# EAGLE design Breakout (EAGLE 9.4.1)
DESIGNER: Hendrik Melse; PROJECT: Backplane Breakout; REV: 1.0.0
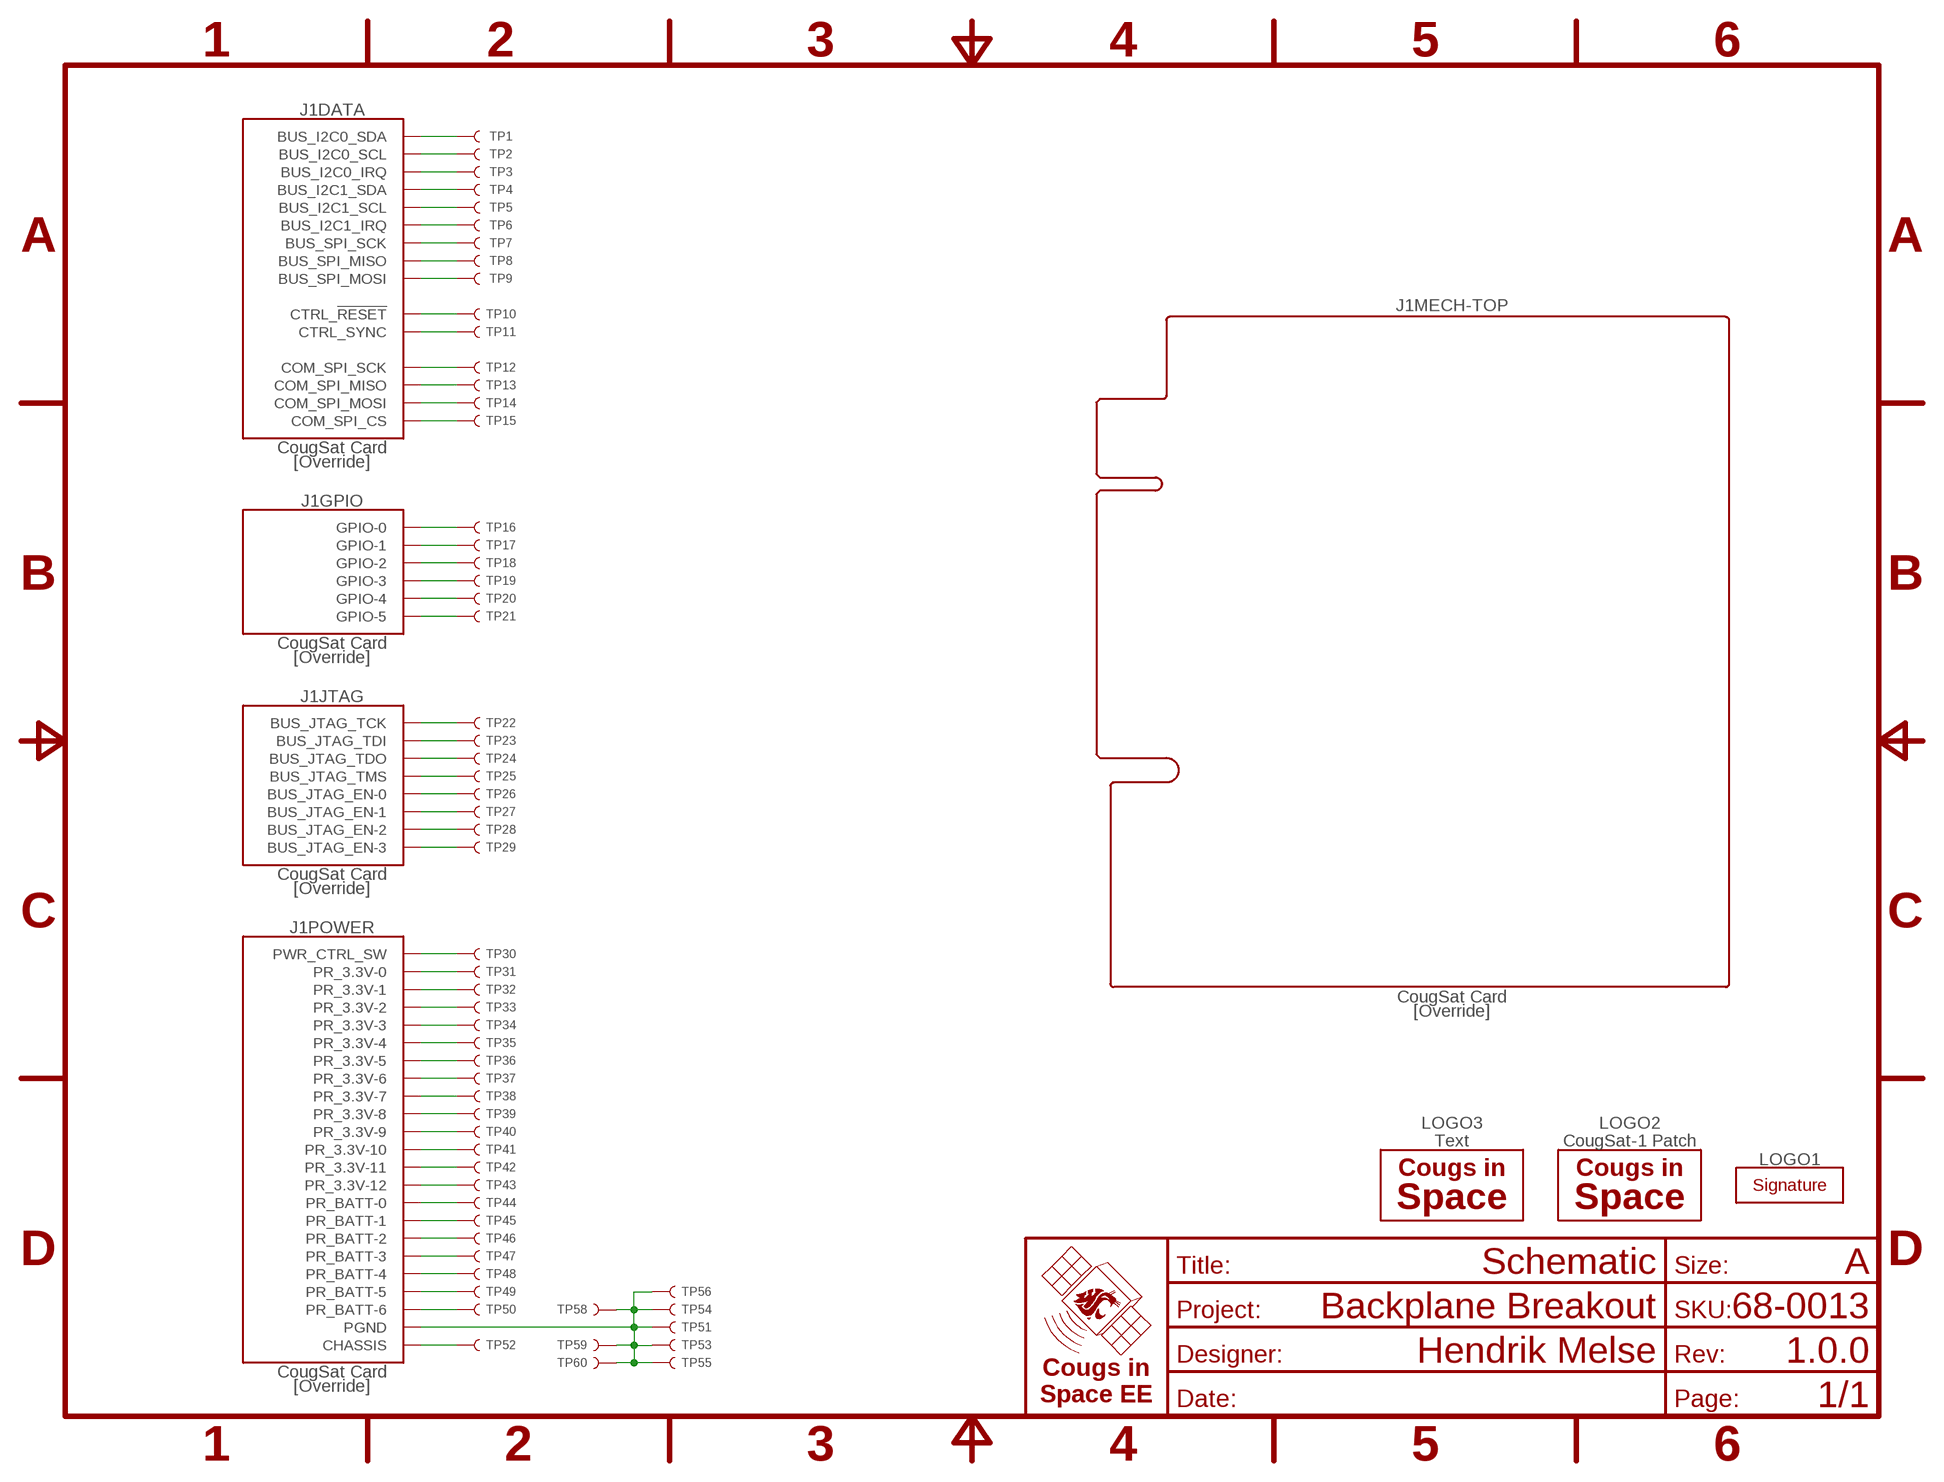
[diagram p0: schematic, sheet 1]
FRAME1 (FRAME-A): PART_NUMBER: 68-0013; TITLE: Schematic

## Parts
J1  CougSat Card  CIS_CARD  [CARD-FULL]
LOGO1  SIGNATUREHENDRIK  [SIGN-HENDRIK]
LOGO2  CougSat-1 Patch  CIS-LOGO-PATCH-1  [CIS-PATCH-1]
LOGO3  Text  CIS-LOGO-TEXT  [CIS-TEXT]
TP1  TEST_POINT-THT-1.0  [THT-1.0]
TP2  TEST_POINT-THT-1.0  [THT-1.0]
TP3  TEST_POINT-THT-1.0  [THT-1.0]
TP4  TEST_POINT-THT-1.0  [THT-1.0]
TP5  TEST_POINT-THT-1.0  [THT-1.0]
TP6  TEST_POINT-THT-1.0  [THT-1.0]
TP7  TEST_POINT-THT-1.0  [THT-1.0]
TP8  TEST_POINT-THT-1.0  [THT-1.0]
TP9  TEST_POINT-THT-1.0  [THT-1.0]
TP10  TEST_POINT-THT-1.0  [THT-1.0]
TP11  TEST_POINT-THT-1.0  [THT-1.0]
TP12  TEST_POINT-THT-1.0  [THT-1.0]
TP13  TEST_POINT-THT-1.0  [THT-1.0]
TP14  TEST_POINT-THT-1.0  [THT-1.0]
TP15  TEST_POINT-THT-1.0  [THT-1.0]
TP16  TEST_POINT-THT-1.0  [THT-1.0]
TP17  TEST_POINT-THT-1.0  [THT-1.0]
TP18  TEST_POINT-THT-1.0  [THT-1.0]
TP19  TEST_POINT-THT-1.0  [THT-1.0]
TP20  TEST_POINT-THT-1.0  [THT-1.0]
TP21  TEST_POINT-THT-1.0  [THT-1.0]
TP22  TEST_POINT-THT-1.0  [THT-1.0]
TP23  TEST_POINT-THT-1.0  [THT-1.0]
TP24  TEST_POINT-THT-1.0  [THT-1.0]
TP25  TEST_POINT-THT-1.0  [THT-1.0]
TP26  TEST_POINT-THT-1.0  [THT-1.0]
TP27  TEST_POINT-THT-1.0  [THT-1.0]
TP28  TEST_POINT-THT-1.0  [THT-1.0]
TP29  TEST_POINT-THT-1.0  [THT-1.0]
TP30  TEST_POINT-THT-1.0  [THT-1.0]
TP31  TEST_POINT-THT-1.0  [THT-1.0]
TP32  TEST_POINT-THT-1.0  [THT-1.0]
TP33  TEST_POINT-THT-1.0  [THT-1.0]
TP34  TEST_POINT-THT-1.0  [THT-1.0]
TP35  TEST_POINT-THT-1.0  [THT-1.0]
TP36  TEST_POINT-THT-1.0  [THT-1.0]
TP37  TEST_POINT-THT-1.0  [THT-1.0]
TP38  TEST_POINT-THT-1.0  [THT-1.0]
TP39  TEST_POINT-THT-1.0  [THT-1.0]
TP40  TEST_POINT-THT-1.0  [THT-1.0]
TP41  TEST_POINT-THT-1.0  [THT-1.0]
TP42  TEST_POINT-THT-1.0  [THT-1.0]
TP43  TEST_POINT-THT-1.0  [THT-1.0]
TP44  TEST_POINT-THT-1.0  [THT-1.0]
TP45  TEST_POINT-THT-1.0  [THT-1.0]
TP46  TEST_POINT-THT-1.0  [THT-1.0]
TP47  TEST_POINT-THT-1.0  [THT-1.0]
TP48  TEST_POINT-THT-1.0  [THT-1.0]
TP49  TEST_POINT-THT-1.0  [THT-1.0]
TP50  TEST_POINT-THT-1.0  [THT-1.0]
TP51  TEST_POINT-THT-1.0  [THT-1.0]
TP52  TEST_POINT-THT-1.0  [THT-1.0]
TP53  TEST_POINT-THT-1.0  [THT-1.0]
TP54  TEST_POINT-THT-1.0  [THT-1.0]
TP55  TEST_POINT-THT-1.0  [THT-1.0]
TP56  TEST_POINT-THT-1.0  [THT-1.0]
TP58  TEST_POINT-THT-1.0  [THT-1.0]
TP59  TEST_POINT-THT-1.0  [THT-1.0]
TP60  TEST_POINT-THT-1.0  [THT-1.0]

## Nets
BUS_12C0_IRQ: J1.A45(DATA:BUS_I2C0_IRQ) J1.B45(DATA:BUS_I2C0_IRQ) TP3.1
BUS_12C0_SCL: J1.A44(DATA:BUS_I2C0_SCL) J1.B44(DATA:BUS_I2C0_SCL) TP2.1
BUS_12C0_SDA: J1.A43(DATA:BUS_I2C0_SDA) J1.B43(DATA:BUS_I2C0_SDA) TP1.1
BUS_12C1_IRQ: J1.A32(DATA:BUS_I2C1_IRQ) J1.B32(DATA:BUS_I2C1_IRQ) TP6.1
BUS_12C1_SCL: J1.A31(DATA:BUS_I2C1_SCL) J1.B31(DATA:BUS_I2C1_SCL) TP5.1
BUS_12C1_SDA: J1.A30(DATA:BUS_I2C1_SDA) J1.B30(DATA:BUS_I2C1_SDA) TP4.1
BUS_JTAG_EN-0: J1.B46(JTAG:BUS_JTAG_EN-0) TP26.1
BUS_JTAG_EN-1: J1.B47(JTAG:BUS_JTAG_EN-1) TP27.1
BUS_JTAG_EN-2: J1.B48(JTAG:BUS_JTAG_EN-2) TP28.1
BUS_JTAG_EN-3: J1.B49(JTAG:BUS_JTAG_EN-3) TP29.1
BUS_JTAG_TCK: J1.A46(JTAG:BUS_JTAG_TCK) TP22.1
BUS_JTAG_TDI: J1.A47(JTAG:BUS_JTAG_TDI) TP23.1
BUS_JTAG_TDO: J1.A48(JTAG:BUS_JTAG_TDO) TP24.1
BUS_JTAG_TMS: J1.A49(JTAG:BUS_JTAG_TMS) TP25.1
BUS_SPI_MISO: J1.A38(DATA:BUS_SPI_MISO) J1.B38(DATA:BUS_SPI_MISO) TP8.1
BUS_SPI_MOSI: J1.A39(DATA:BUS_SPI_MOSI) J1.B39(DATA:BUS_SPI_MOSI) TP9.1
BUS_SPI_SCK: J1.A37(DATA:BUS_SPI_SCK) J1.B37(DATA:BUS_SPI_SCK) TP7.1
CHASSIS: J1.CHASSIS@1(POWER:CHASSIS) J1.CHASSIS@2(POWER:CHASSIS) J1.CHASSIS@3(POWER:CHASSIS) J1.CHASSIS@4(POWER:CHASSIS) TP52.1
COM_SPI_CS: J1.A36(DATA:COM_SPI_CS) J1.B36(DATA:COM_SPI_CS) TP15.1
COM_SPI_MISO: J1.A34(DATA:COM_SPI_MISO) J1.B34(DATA:COM_SPI_MISO) TP13.1
COM_SPI_MOSI: J1.A35(DATA:COM_SPI_MOSI) J1.B35(DATA:COM_SPI_MOSI) TP14.1
COM_SPI_SCK: J1.A33(DATA:COM_SPI_SCK) J1.B33(DATA:COM_SPI_SCK) TP12.1
CTRL_RESET: J1.A41(DATA:CTRL_!RESET) J1.B41(DATA:CTRL_!RESET) TP10.1
CTRL_SYNC: J1.A42(DATA:CTRL_SYNC) J1.B42(DATA:CTRL_SYNC) TP11.1
GPIO-0: J1.A24(GPIO:GPIO-0) TP16.1
GPIO-1: J1.A25(GPIO:GPIO-1) TP17.1
GPIO-2: J1.A26(GPIO:GPIO-2) TP18.1
GPIO-3: J1.A27(GPIO:GPIO-3) TP19.1
GPIO-4: J1.A28(GPIO:GPIO-4) TP20.1
GPIO-5: J1.A29(GPIO:GPIO-5) TP21.1
PGND: J1.A21(POWER:PGND) J1.A22(POWER:PGND) J1.A23(POWER:PGND) J1.B21(POWER:PGND) J1.B22(POWER:PGND) J1.B23(POWER:PGND) J1.B24(POWER:PGND) J1.B25(POWER:PGND) J1.B26(POWER:PGND) J1.B27(POWER:PGND) J1.B28(POWER:PGND) J1.B29(POWER:PGND) TP51.1 TP53.1 TP54.1 TP55.1 TP56.1 TP58.1 TP59.1 TP60.1
PR_3.3V-0: J1.A1(POWER:PR_3.3V-0) J1.B1(POWER:PR_3.3V-0) TP31.1
PR_3.3V-1: J1.A2(POWER:PR_3.3V-1) J1.B2(POWER:PR_3.3V-1) TP32.1
PR_3.3V-2: J1.A3(POWER:PR_3.3V-2) J1.B3(POWER:PR_3.3V-2) TP33.1
PR_3.3V-3: J1.A4(POWER:PR_3.3V-3) J1.B4(POWER:PR_3.3V-3) TP34.1
PR_3.3V-4: J1.A5(POWER:PR_3.3V-4) J1.B5(POWER:PR_3.3V-4) TP35.1
PR_3.3V-5: J1.A6(POWER:PR_3.3V-5) J1.B6(POWER:PR_3.3V-5) TP36.1
PR_3.3V-6: J1.A7(POWER:PR_3.3V-6) J1.B7(POWER:PR_3.3V-6) TP37.1
PR_3.3V-7: J1.A8(POWER:PR_3.3V-7) J1.B8(POWER:PR_3.3V-7) TP38.1
PR_3.3V-8: J1.A9(POWER:PR_3.3V-8) J1.B9(POWER:PR_3.3V-8) TP39.1
PR_3.3V-9: J1.A10(POWER:PR_3.3V-9) J1.B10(POWER:PR_3.3V-9) TP40.1
PR_3.3V-10: J1.A11(POWER:PR_3.3V-10) J1.B11(POWER:PR_3.3V-10) TP41.1
PR_3.3V-11: J1.A12(POWER:PR_3.3V-11) J1.B12(POWER:PR_3.3V-11) TP42.1
PR_3.3V-12: J1.A13(POWER:PR_3.3V-12) J1.B13(POWER:PR_3.3V-12) TP43.1
PR_BATT-0: J1.A14(POWER:PR_BATT-0) J1.B14(POWER:PR_BATT-0) TP44.1
PR_BATT-1: J1.A15(POWER:PR_BATT-1) J1.B15(POWER:PR_BATT-1) TP45.1
PR_BATT-2: J1.A16(POWER:PR_BATT-2) J1.B16(POWER:PR_BATT-2) TP46.1
PR_BATT-3: J1.A17(POWER:PR_BATT-3) J1.B17(POWER:PR_BATT-3) TP47.1
PR_BATT-4: J1.A18(POWER:PR_BATT-4) J1.B18(POWER:PR_BATT-4) TP48.1
PR_BATT-5: J1.A19(POWER:PR_BATT-5) J1.B19(POWER:PR_BATT-5) TP49.1
PR_BATT-6: J1.A20(POWER:PR_BATT-6) J1.B20(POWER:PR_BATT-6) TP50.1
PWR_CTRL_SW: J1.A40(POWER:PWR_CTRL_SW) J1.B40(POWER:PWR_CTRL_SW) TP30.1

## Library data of the parts
J1 = CougsInSpace-Boards:CIS_CARD: CougSat Card; SKU: [Override]
LOGO1 = CougsInSpace-Aesthetics:SIGNATURE: Designer's (Artist's) Signature
LOGO2 LOGO3 = CougsInSpace-Aesthetics:CIS-LOGO: Cougs in Space Artwork These are the Cougs in Space logos and mission patches
TP1-TP56 TP58-TP60 = CougsInSpace-Connectors:TEST_POINT: Test Point Used to probe points in a circuit for debugging or general measurement

## Board
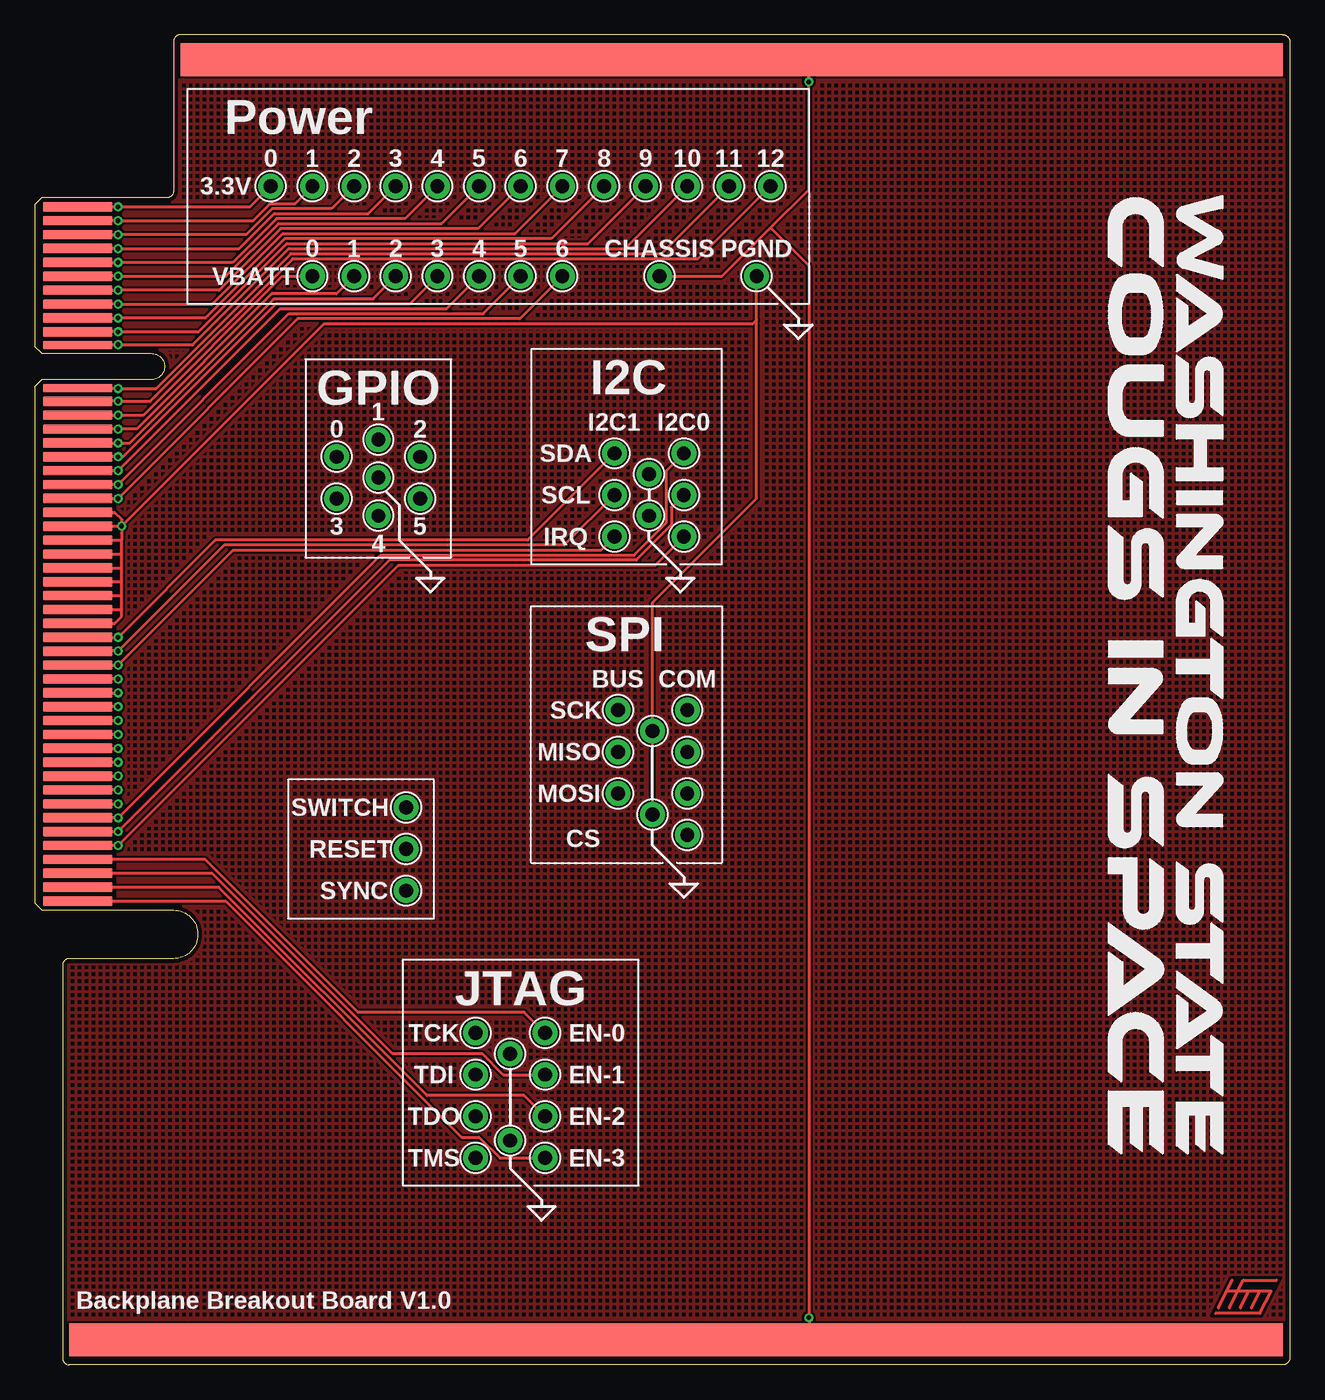
[diagram p1: board, top side]
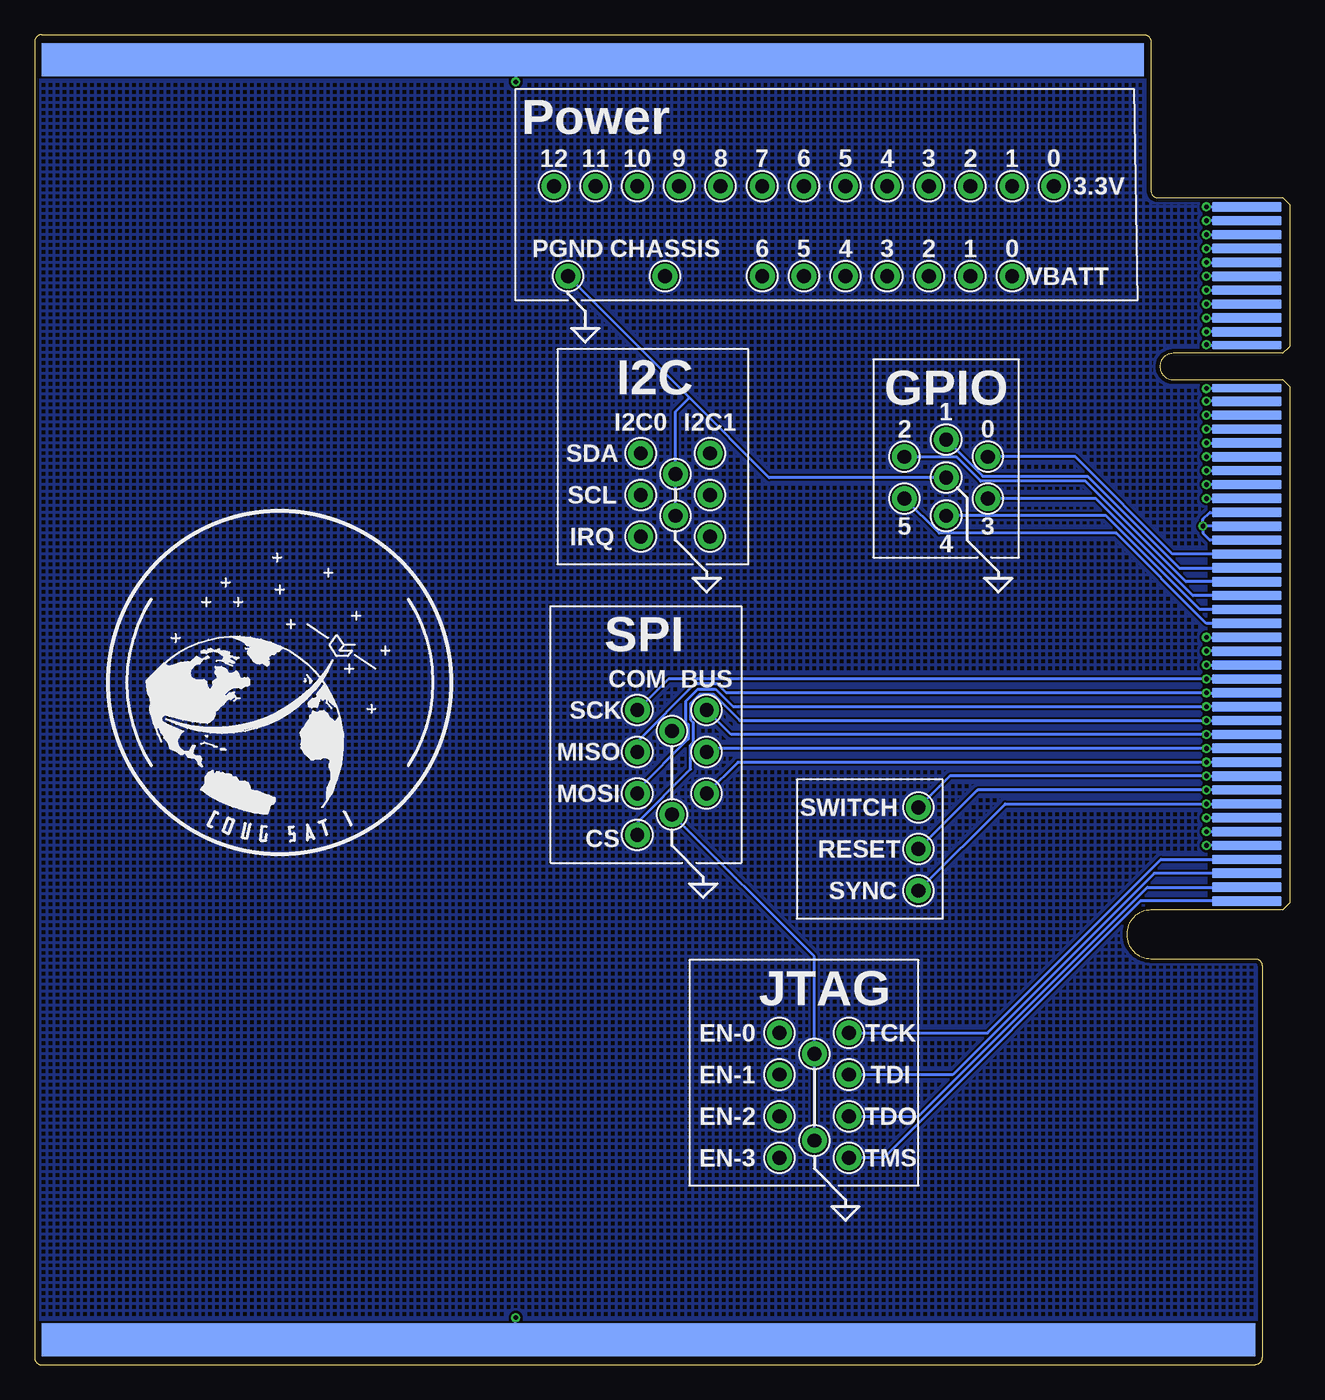
[diagram p2: board, bottom side, seen from below]

Size 90.4 x 95.8 mm. Coordinates in mm from the lower left corner, seen from the top.
Copper layers (1*16): Top 0.035mm / dielectric 1.6mm / Bottom 0.035mm
Design rules "CougsInSpace *": minimum track width 0.16mm, minimum drill 0.3mm, track to track 0.16mm, track to pad 0.16mm, pad to pad 0.16mm, via to via 0.16mm, smd to smd 0mil, copper to edge 0.3mm, drill to drill 0.3mm, minimum pad ring 0.15mm, minimum via ring 0.15mm, stop-mask expansion 0mil, vias tented up to drill 1mm, thermal gap 0.25mm

### Footprints (pad centres in the part's own frame; a part is rotated, then mirrored left to right if it is on the bottom)
CARD-FULL = smd 5 x 0.7 bottom: A1 3.1,35.5; A2 3.1,34.5; A3 3.1,33.5; A4 3.1,32.5; A5 3.1,31.5; A6 3.1,30.5; A7 3.1,29.5; A8 3.1,28.5; A9 3.1,27.5; A10 3.1,26.5; A13 3.1,21.5; A14 3.1,20.5; A15 3.1,19.5; A16 3.1,18.5; A17 3.1,17.5; A18 3.1,16.5; A19 3.1,15.5; A20 3.1,14.5; A21 3.1,13.5; A22 3.1,12.5; A23 3.1,11.5; A24 3.1,10.5; A25 3.1,9.5; A26 3.1,8.5; A27 3.1,7.5; A28 3.1,6.5; A29 3.1,5.5; A30 3.1,4.5; A31 3.1,3.5; A32 3.1,2.5; A33 3.1,1.5; A34 3.1,0.5; A35 3.1,-0.5; A36 3.1,-1.5; A37 3.1,-2.5; A38 3.1,-3.5; A39 3.1,-4.5; A40 3.1,-5.5; A41 3.1,-6.5; A42 3.1,-7.5; A43 3.1,-8.5; A44 3.1,-9.5; A45 3.1,-10.5; A46 3.1,-11.5; A47 3.1,-12.5; A48 3.1,-13.5; A49 3.1,-14.5 | smd 5 x 0.6 bottom: A11 3.1,25.55; A12 3.1,22.45 | smd 5 x 0.7: B1 3.1,35.5; B2 3.1,34.5; B3 3.1,33.5; B4 3.1,32.5; B5 3.1,31.5; B6 3.1,30.5; B7 3.1,29.5; B8 3.1,28.5; B9 3.1,27.5; B10 3.1,26.5; B13 3.1,21.5; B14 3.1,20.5; B15 3.1,19.5; B16 3.1,18.5; B17 3.1,17.5; B18 3.1,16.5; B19 3.1,15.5; B20 3.1,14.5; B21 3.1,13.5; B22 3.1,12.5; B23 3.1,11.5; B24 3.1,10.5; B25 3.1,9.5; B26 3.1,8.5; B27 3.1,7.5; B28 3.1,6.5; B29 3.1,5.5; B30 3.1,4.5; B31 3.1,3.5; B32 3.1,2.5; B33 3.1,1.5; B34 3.1,0.5; B35 3.1,-0.5; B36 3.1,-1.5; B37 3.1,-2.5; B38 3.1,-3.5; B39 3.1,-4.5; B40 3.1,-5.5; B41 3.1,-6.5; B42 3.1,-7.5; B43 3.1,-8.5; B44 3.1,-9.5; B45 3.1,-10.5; B46 3.1,-11.5; B47 3.1,-12.5; B48 3.1,-13.5; B49 3.1,-14.5 | smd 5 x 0.6: B11 3.1,25.55; B12 3.1,22.45 | smd 79.4 x 2.4 bottom: CHASSIS@1 50.2,46.1 | smd 79.4 x 2.4: CHASSIS@2 50.2,46.1 | smd 87.4 x 2.4 bottom: CHASSIS@3 46.2,-46.1 | smd 87.4 x 2.4: CHASSIS@4 46.2,-46.1
THT-1.0 = drill 1 pad 1.8: 1 0,0

### Placement (x,y rotation side)
J1  0,47.9 0 top
LOGO1  87.25,4.9 0 top
LOGO2  72.75,49.15 0 bottom
LOGO3  81.75,49.4 270 top
TP1  46.75,65.65 0 top
TP2  46.75,62.65 0 top
TP3  46.75,59.65 0 top
TP4  41.75,65.65 0 top
TP5  41.75,62.65 0 top
TP6  41.75,59.65 0 top
TP7  42,47.15 0 top
TP8  42,44.15 0 top
TP9  42,41.15 0 top
TP10  26.75,37.15 0 top
TP11  26.75,34.15 0 top
TP12  47,47.15 0 top
TP13  47,44.15 0 top
TP14  47,41.15 0 top
TP15  47,38.15 0 top
TP16  21.75,65.4 0 top
TP17  24.75,66.65 0 top
TP18  27.75,65.4 0 top
TP19  21.75,62.4 0 top
TP20  24.75,61.15 0 top
TP21  27.75,62.4 0 top
TP22  31.75,23.9 0 top
TP23  31.75,20.9 0 top
TP24  31.75,17.9 0 top
TP25  31.75,14.9 0 top
TP26  36.75,23.9 0 top
TP27  36.75,20.9 0 top
TP28  36.75,17.9 0 top
TP29  36.75,14.9 0 top
TP30  26.75,40.15 0 top
TP31  17,84.9 0 top
TP32  20,84.9 0 top
TP33  23,84.9 0 top
TP34  26,84.9 0 top
TP35  29,84.9 0 top
TP36  32,84.9 0 top
TP37  35,84.9 0 top
TP38  38,84.9 0 top
TP39  41,84.9 0 top
TP40  44,84.9 0 top
TP41  47,84.9 0 top
TP42  50,84.9 0 top
TP43  53,84.9 0 top
TP44  20,78.4 0 top
TP45  23,78.4 0 top
TP46  26,78.4 0 top
TP47  29,78.4 0 top
TP48  32,78.4 0 top
TP49  35,78.4 0 top
TP50  38,78.4 0 top
TP51  52,78.4 0 top
TP52  45,78.4 0 top
TP53  24.75,63.9 0 top
TP54  44.25,64.15 0 top
TP55  44.25,61.15 0 top
TP56  44.5,45.65 0 top
TP58  44.5,39.65 0 top
TP59  34.25,22.4 0 top
TP60  34.25,16.15 0 top

### Tracks (layer width: path | path; a pad name or v marks a point on that pad's centre or on a via)
BALANCING_BOTTOM
  pour Bottom (rank 6, hatched): 2,-0.1 2,29.4 10.5,29.4 11.5,30.4 11.5,31.65 10.5,32.65 6,32.65 6,70.9 8.5,70.9 9.25,71.65 9.25,72.15 8.5,72.9 6,72.9 6,84.15 10,84.15 10,95.9 90.5,95.9 90.5,-0.1
BALANCING_TOP
  pour Top (rank 6, hatched): 10,95.9 90.5,95.9 90.5,-0.1 2,-0.1 2,29.4 10.5,29.4 11.5,30.4 11.5,31.65 10.5,32.65 6,32.65 6,70.9 8.5,70.9 9.25,71.65 9.25,72.15 8.5,72.9 6,72.9 6,84.15 10,84.15
BUS_12C0_IRQ  (via drill 0.35)
  Top 0.2: J1.B45 v6,37.4 26.2,57.6 44.7,57.6 TP3.1
  Bottom 0.2: J1.B45 v6,37.4
BUS_12C0_SCL  (via drill 0.35)
  Top 0.2: J1.B44 v6,38.4 25.56,57.96 43.32,57.96 45.86,60.5 45.86,61.76 TP2.1
  Bottom 0.2: v6,38.4 J1.B44
BUS_12C0_SDA  (via drill 0.35)
  Top 0.2: J1.B43 v6,39.4 24.92,58.32 43.17,58.32 45.5,60.65 45.5,64.4 TP1.1
  Bottom 0.2: J1.B43 v6,39.4
BUS_12C1_IRQ  (via drill 0.35)
  Top 0.2: J1.B32 v6,50.4 14.28,58.68 40.78,58.68 TP6.1
  Bottom 0.2: v6,50.4 J1.B32
BUS_12C1_SCL  (via drill 0.35)
  Top 0.2: J1.B31 v6,51.4 13.64,59.04 38.14,59.04 TP5.1
  Bottom 0.2: J1.B31 v6,51.4
BUS_12C1_SDA  (via drill 0.35)
  Top 0.2: J1.B30 v6,52.4 13,59.4 35.5,59.4 TP4.1
  Bottom 0.2: v6,52.4 J1.B30
BUS_JTAG_EN-0
  Top 0.2: TP26.1 35.25,25.4 23.28,25.4 12.28,36.4 J1.B46
BUS_JTAG_EN-1
  Top 0.2: TP27.1 33.75,20.9 32.25,22.4 25.77,22.4 12.77,35.4 J1.B47
BUS_JTAG_EN-2
  Top 0.2: TP28.1 35.24,19.4 28.25,19.4 13.26,34.4 J1.B48
BUS_JTAG_EN-3
  Top 0.2: J1.B49 13.75,33.4 30.75,16.4 32,16.4 33.5,14.9 TP29.1
BUS_JTAG_TCK
  Bottom 0.2: TP22.1 21.78,23.9 9.28,36.4 J1.A46
BUS_JTAG_TDI
  Bottom 0.2: J1.A47 9.77,35.4 24.27,20.9 TP23.1
BUS_JTAG_TDO
  Bottom 0.2: TP24.1 26.76,17.9 10.26,34.4 J1.A48
BUS_JTAG_TMS
  Bottom 0.2: J1.A49 10.75,33.4 29.25,14.9 TP25.1
BUS_SPI_MISO  (via drill 0.35)
  Top 0.2: J1.B38 v6,44.4
  Bottom 0.2: J1.B38 v6,44.4 41.75,44.4 TP8.1
BUS_SPI_MOSI  (via drill 0.35)
  Top 0.2: v6,43.4 J1.B39
  Bottom 0.2: J1.B39 v6,43.4 39.75,43.4 TP9.1
BUS_SPI_SCK  (via drill 0.35)
  Top 0.2: v6,45.4 J1.B37
  Bottom 0.2: J1.B37 v6,45.4 40.25,45.4 TP7.1
CHASSIS  (via drill 0.35)
  Top 0.2: TP52.1 49.5,78.4 53,81.9 | J1.CHASSIS@2 54.9,94 55.75,93.15 v55.75,92.4 55.75,84.65 53,81.9 | 53,81.9 55.75,79.15 v55.75,3.4 55.75,2.65 54.9,1.8 J1.CHASSIS@4
  Bottom 0.2: J1.CHASSIS@2 54.9,94 55.75,93.15 v55.75,92.4 | J1.CHASSIS@4 54.9,1.8 55.75,2.65 v55.75,3.4
COM_SPI_CS  (via drill 0.35)
  Top 0.2: J1.B36 v6,46.4
  Bottom 0.2: J1.B36 v6,46.4 39.61,46.4 41.52,48.31 42.48,48.31 43.16,47.63 43.16,46.46 42.98,46.28 42.98,44.81 43.16,44.63 43.16,42.9 47,39.06 TP15.1
COM_SPI_MISO  (via drill 0.35)
  Top 0.2: J1.B34 v6,48.4
  Bottom 0.2: J1.B34 v6,48.4 40.59,48.4 41.22,49.03 42.87,49.03 47,44.9 TP13.1
COM_SPI_MOSI  (via drill 0.35)
  Top 0.2: v6,47.4 J1.B35
  Bottom 0.2: J1.B35 v6,47.4 40.1,47.4 41.37,48.67 42.63,48.67 43.52,47.78 43.52,46.31 43.34,46.13 43.34,45.06 47,41.4 TP14.1
COM_SPI_SCK  (via drill 0.35)
  Top 0.2: v6,49.4 J1.B33
  Bottom 0.2: J1.B33 v6,49.4 44.75,49.4 TP12.1
CTRL_RESET  (via drill 0.35)
  Top 0.2: v6,41.4 J1.B41
  Bottom 0.2: J1.B41 v6,41.4 22.5,41.4 TP10.1
CTRL_SYNC  (via drill 0.35)
  Top 0.2: J1.B42 v6,40.4
  Bottom 0.2: J1.B42 v6,40.4 20.5,40.4 TP11.1
GPIO-0
  Bottom 0.2: TP16.1 15.45,65.4 8.45,58.4 J1.A24
GPIO-1
  Bottom 0.2: TP17.1 22.25,64.15 22.24,64.14 22.11,64.01 14.57,64.01 7.96,57.4 J1.A25
GPIO-2
  Bottom 0.2: TP18.1 24.01,65.4 22.26,63.65 14.72,63.65 7.47,56.4 J1.A26
GPIO-3
  Bottom 0.2: J1.A27 6.98,55.4 13.98,62.4 TP19.1
GPIO-4
  Bottom 0.2: TP20.1 13.24,61.15 6.49,54.4 J1.A28
GPIO-5
  Bottom 0.2: J1.A29 6,53.4 12.5,59.9 25.25,59.9 TP21.1
PGND  (via drill 0.35)
  Top 0.2: TP58.1 TP56.1 44.5,54.9 52,62.4 52,75.25 | 52,75.25 TP51.1 | J1.B22 v6.25,60.4 | v6.25,60.4 20.83,74.98 51.73,74.98 52,75.25 | J1.B21 5.75,61.4 6.25,60.9 v6.25,60.4 | J1.B23 6.25,59.4 | v6.25,60.4 6.25,59.9 6.25,59.4 | J1.B24 6.25,58.4 | 6.25,58.4 6.25,58.9 6.25,59.4 | J1.B25 6.25,57.4 | 6.25,57.4 6.25,58.4 | J1.B26 6.25,56.4 | 6.25,56.4 6.25,57.4 | J1.B27 6.25,55.4 | 6.25,55.4 6.25,56.4 | J1.B28 6.25,54.4 | 6.25,54.4 6.25,55.4 | J1.B29 5.75,53.4 6.25,53.9 6.25,54.4
  Bottom 0.2: TP60.1 TP59.1 34.25,29.4 TP58.1 | TP55.1 TP54.1 44.25,68.65 43.25,69.65 | 43.25,69.65 TP51.1 | J1.B23 5.75,59.4 6.25,59.9 v6.25,60.4 | J1.B21 5.75,61.4 6.25,60.9 v6.25,60.4 | J1.B22 v6.25,60.4 | TP53.1 37.5,63.9 43.25,69.65
PR_3.3V-0  (via drill 0.35)
  Top 0.2: J1.B1 v6,83.4 15.5,83.4 TP31.1
  Bottom 0.2: v6,83.4 J1.B1
PR_3.3V-1  (via drill 0.35)
  Top 0.2: J1.B2 v6,82.4 15.72,82.4 16.96,83.64 18.74,83.64 TP32.1
  Bottom 0.2: J1.B2 v6,82.4
PR_3.3V-2  (via drill 0.35)
  Top 0.2: J1.B3 v6,81.4 15.23,81.4 17.11,83.28 21.38,83.28 TP33.1
  Bottom 0.2: v6,81.4 J1.B3
PR_3.3V-3  (via drill 0.35)
  Top 0.2: J1.B4 v6,80.4 14.74,80.4 17.26,82.92 24.02,82.92 TP34.1
  Bottom 0.2: J1.B4 v6,80.4
PR_3.3V-4  (via drill 0.35)
  Top 0.2: J1.B5 v6,79.4 14.25,79.4 17.41,82.56 26.66,82.56 TP35.1
  Bottom 0.2: v6,79.4 J1.B5
PR_3.3V-5  (via drill 0.35)
  Top 0.2: J1.B6 v6,78.4 13.76,78.4 17.56,82.2 29.3,82.2 TP36.1
  Bottom 0.2: J1.B6 v6,78.4
PR_3.3V-6  (via drill 0.35)
  Top 0.2: J1.B7 v6,77.4 13.27,77.4 17.71,81.84 31.94,81.84 TP37.1
  Bottom 0.2: v6,77.4 J1.B7
PR_3.3V-7  (via drill 0.35)
  Top 0.2: J1.B8 v6,76.4 12.78,76.4 17.86,81.48 34.58,81.48 TP38.1
  Bottom 0.2: J1.B8 v6,76.4
PR_3.3V-8  (via drill 0.35)
  Top 0.2: J1.B9 v6,75.4 12.29,75.4 18.01,81.12 37.22,81.12 TP39.1
  Bottom 0.2: v6,75.4 J1.B9
PR_3.3V-9  (via drill 0.35)
  Top 0.2: J1.B10 v6,74.4 11.8,74.4 18.16,80.76 39.86,80.76 TP40.1
  Bottom 0.2: J1.B10 v6,74.4
PR_3.3V-10  (via drill 0.35)
  Top 0.2: TP41.1 42.5,80.4 18.31,80.4 11.38,73.47 v6,73.47 5.97,73.45 J1.B11
  Bottom 0.2: v6,73.47 5.97,73.45 J1.B11
PR_3.3V-11  (via drill 0.35)
  Top 0.2: TP42.1 45.14,80.04 18.46,80.04 8.74,70.33 v6,70.33 5.97,70.35 J1.B12
  Bottom 0.2: v6,70.33 5.97,70.35 J1.B12
PR_3.3V-12  (via drill 0.35)
  Top 0.2: J1.B13 v6,69.4 8.33,69.4 18.61,79.68 47.78,79.68 TP43.1
  Bottom 0.2: J1.B13 v6,69.4
PR_BATT-0  (via drill 0.35)
  Top 0.2: J1.B14 v6,68.4 7.83,68.4 17.84,78.4 TP44.1
  Bottom 0.2: v6,68.4 J1.B14
PR_BATT-1  (via drill 0.35)
  Top 0.2: J1.B15 v6,67.4 7.34,67.4 17.08,77.14 21.74,77.14 TP45.1
  Bottom 0.2: J1.B15 v6,67.4
PR_BATT-2  (via drill 0.35)
  Top 0.2: J1.B16 v6,66.4 6.85,66.4 17.23,76.78 24.38,76.78 TP46.1
  Bottom 0.2: v6,66.4 J1.B16
PR_BATT-3  (via drill 0.35)
  Top 0.2: J1.B17 v6,65.4 6.36,65.4 7,66.04 17.38,76.42 27.02,76.42 TP47.1
  Bottom 0.2: J1.B17 v6,65.4
PR_BATT-4  (via drill 0.35)
  Top 0.2: J1.B18 v6,64.4 17.66,76.06 29.66,76.06 TP48.1
  Bottom 0.2: v6,64.4 J1.B18
PR_BATT-5  (via drill 0.35)
  Top 0.2: J1.B19 v6,63.4 18.3,75.7 32.3,75.7 TP49.1
  Bottom 0.2: J1.B19 v6,63.4
PR_BATT-6  (via drill 0.35)
  Top 0.2: J1.B20 v6,62.4 18.94,75.34 34.94,75.34 TP50.1
  Bottom 0.2: v6,62.4 J1.B20
PWR_CTRL_SW  (via drill 0.35)
  Top 0.2: J1.B40 v6,42.4
  Bottom 0.2: J1.B40 v6,42.4 24.5,42.4 TP30.1

### Text on the board
tPlace: Power | 0 | 1 | 2 | 3 | 4 | 5 | 6 | 7 | 8 | 9 | 10 | 11 | 12 | 3.3V | 0 | 1 | 2 | 3 | 4 | 5 | 6 | CHASSIS | PGND | VBATT | I2C | GPIO | 1 | 0 | 2 | I2C1 | I2C0 | SDA | SCL | 3 | 5 | IRQ | 4 | SPI | BUS | COM | SCK | MISO | MOSI | SWITCH | CS | RESET | SYNC | JTAG | TCK | EN-0 | TDI | EN-1 | TDO | EN-2 | TMS | EN-3 | Backplane Breakout Board V1.0
bPlace: Power | 0 | 1 | 2 | 3 | 4 | 5 | 6 | 7 | 8 | 9 | 10 | 11 | 12 | 3.3V | 0 | 1 | 2 | 3 | 4 | 5 | 6 | CHASSIS | PGND | VBATT | I2C | GPIO | 1 | 0 | 2 | I2C1 | I2C0 | SDA | SCL | 3 | 5 | IRQ | 4 | SPI | BUS | COM | SCK | MISO | MOSI | SWITCH | CS | RESET | SYNC | JTAG | TCK | EN-0 | TDI | EN-1 | TDO | EN-2 | TMS | EN-3